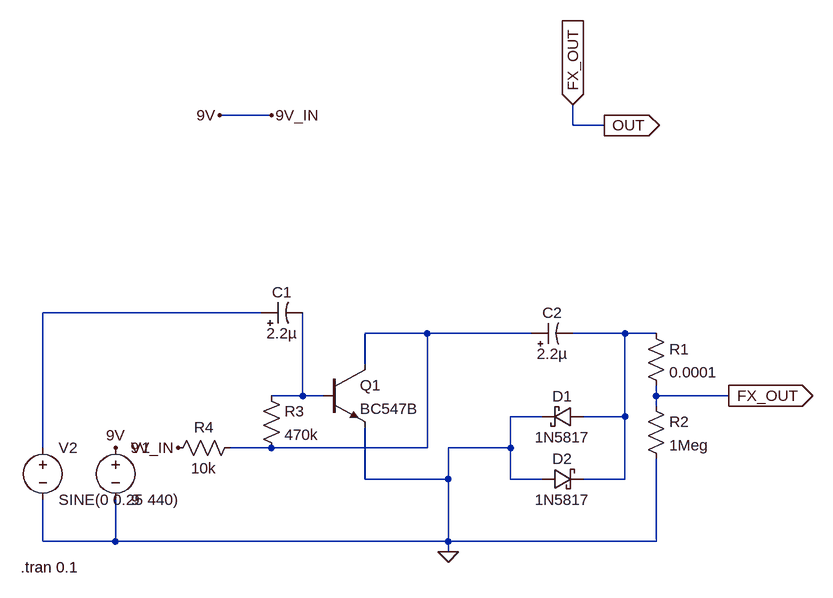
[diagram p0: schematic DoomBox_LTSPICE_MODEL.asc]
DoomBox_LTSPICE_MODEL.asc, the LTspice schematic file:
Version 4
SHEET 1 888 680
WIRE 32 -304 -48 -304
WIRE 496 -288 496 -320
WIRE 544 -288 496 -288
WIRE 16 0 -320 0
WIRE 272 32 176 32
WIRE 432 32 272 32
WIRE 576 32 496 32
WIRE 624 32 576 32
WIRE 176 80 176 32
WIRE 80 128 80 0
WIRE 80 128 32 128
WIRE 112 128 80 128
WIRE 624 128 624 112
WIRE 736 128 624 128
WIRE 624 144 624 128
WIRE 448 160 400 160
WIRE 576 160 576 32
WIRE 576 160 512 160
WIRE -320 208 -320 0
WIRE 32 208 -32 208
WIRE 272 208 272 32
WIRE 272 208 32 208
WIRE 400 208 400 160
WIRE 400 208 304 208
WIRE 176 256 176 176
WIRE 304 256 304 208
WIRE 304 256 176 256
WIRE 400 256 400 208
WIRE 448 256 400 256
WIRE 576 256 576 160
WIRE 576 256 512 256
WIRE -320 352 -320 288
WIRE -208 352 -208 288
WIRE -208 352 -320 352
WIRE 304 352 304 256
WIRE 304 352 -208 352
WIRE 624 352 624 224
WIRE 624 352 304 352
WIRE 304 368 304 352
FLAG 304 368 0
FLAG 736 128 FX_OUT
IOPIN 736 128 Out
FLAG 544 -288 OUT
IOPIN 544 -288 Out
FLAG 496 -320 FX_OUT
IOPIN 496 -320 In
FLAG -208 208 9V
FLAG -48 -304 9V
FLAG -112 208 9V_IN
FLAG 32 -304 9V_IN
SYMBOL npn 112 80 R0
SYMATTR InstName Q1
SYMATTR Value BC547B
SYMBOL polcap 16 16 R270
WINDOW 0 32 32 VTop 2
WINDOW 3 0 32 VBottom 2
SYMATTR InstName C1
SYMATTR Value 2.2µ
SYMATTR Description Capacitor
SYMATTR Type cap
SYMATTR SpiceLine V=50 Irms=13m Rser=2.58924 Lser=429.438p mfg="Würth Elektronik" pn="865250640006 WCAP-ASNP 4x5,5" type="Al electrolytic"
SYMBOL polcap 432 48 R270
WINDOW 0 32 32 VTop 2
WINDOW 3 0 32 VBottom 2
SYMATTR InstName C2
SYMATTR Value 2.2µ
SYMATTR Description Capacitor
SYMATTR Type cap
SYMATTR SpiceLine V=50 Irms=13m Rser=2.58924 Lser=429.438p mfg="Würth Elektronik" pn="865250640006 WCAP-ASNP 4x5,5" type="Al electrolytic"
SYMBOL schottky 512 144 R90
WINDOW 0 0 32 VBottom 2
WINDOW 3 32 32 VTop 2
SYMATTR InstName D1
SYMATTR Value 1N5817
SYMATTR Description Diode
SYMATTR Type diode
SYMBOL schottky 448 272 R270
WINDOW 0 32 32 VTop 2
WINDOW 3 0 32 VBottom 2
SYMATTR InstName D2
SYMATTR Value 1N5817
SYMATTR Description Diode
SYMATTR Type diode
SYMBOL res 608 16 R0
SYMATTR InstName R1
SYMATTR Value 0.0001
SYMATTR SpiceLine tol=1 pwr=0.1
SYMBOL res 608 128 R0
SYMATTR InstName R2
SYMATTR Value 1Meg
SYMATTR SpiceLine tol=1 pwr=0.1
SYMBOL res 16 112 R0
SYMATTR InstName R3
SYMATTR Value 470k
SYMATTR SpiceLine tol=1 pwr=0.1
SYMBOL res -16 192 R90
WINDOW 0 0 56 VBottom 2
WINDOW 3 32 56 VTop 2
SYMATTR InstName R4
SYMATTR Value 10k
SYMATTR SpiceLine tol=1 pwr=0.1
SYMBOL voltage -208 192 R0
WINDOW 123 0 0 Left 0
WINDOW 39 0 0 Left 0
SYMATTR InstName V1
SYMATTR Value 9
SYMBOL voltage -320 192 R0
WINDOW 123 0 0 Left 0
WINDOW 39 0 0 Left 0
SYMATTR InstName V2
SYMATTR Value SINE(0 0.25 440)
TEXT -354 392 Left 2 !.tran 0.1

The netlist it stands for:
* DoomBox_LTSPICE_MODEL.asc
Q1 N002 N004 0 0 BC547B
C1 N001 N004 2.2µ V=50 Irms=13m Rser=2.58924 Lser=429.438p mfg="Würth Elektronik" pn="865250640006 WCAP-ASNP 4x5,5" type="Al electrolytic"
C2 N002 N003 2.2µ V=50 Irms=13m Rser=2.58924 Lser=429.438p mfg="Würth Elektronik" pn="865250640006 WCAP-ASNP 4x5,5" type="Al electrolytic"
D1 N003 0 1N5817
D2 0 N003 1N5817
R1 N003 OUT 0.0001 tol=1 pwr=0.1
R2 OUT 0 1Meg tol=1 pwr=0.1
R3 N004 N002 470k tol=1 pwr=0.1
R4 N002 9V_IN 10k tol=1 pwr=0.1
V1 9V_IN 0 9
V2 N001 0 SINE(0 0.25 440)
.model D D
.lib standard.dio
.model NPN NPN
.model PNP PNP
.lib standard.bjt
.tran 0.1
.backanno
.end